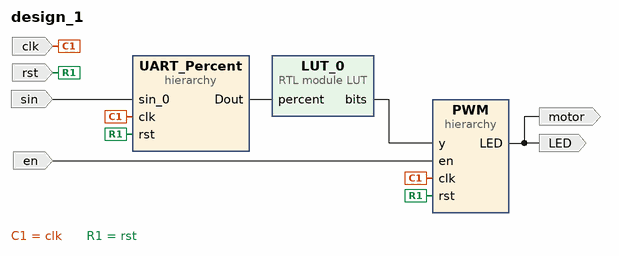
[diagram p0: block diagram of the top level]
# Vivado block design design_1, xc7z020clg400-1, Vivado 2021.1.1
create_bd_design design_1

create_bd_port -dir I -type clk clk
create_bd_port -dir I en
create_bd_port -dir I -type rst rst
create_bd_port -dir O LED
create_bd_port -dir I sin
create_bd_port -dir O motor

create_bd_cell -type hier PWM
create_bd_cell -type hier UART_Percent
create_bd_cell -type module -reference LUT LUT_0

# ---- hierarchy /PWM ----
current_bd_instance /PWM
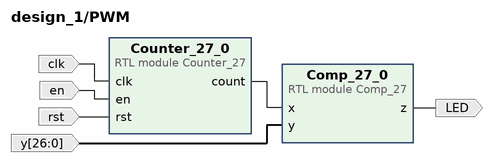
[diagram p1: block diagram inside /PWM]
create_bd_pin -dir I en
create_bd_pin -dir I -type clk clk
create_bd_pin -dir I -type rst rst
create_bd_pin -dir I -from 26 -to 0 y
create_bd_pin -dir O LED

create_bd_cell -type module -reference Comp_27 Comp_27_0
create_bd_cell -type module -reference Counter_27 Counter_27_0

# ---- hierarchy /UART_Percent ----
current_bd_instance /UART_Percent
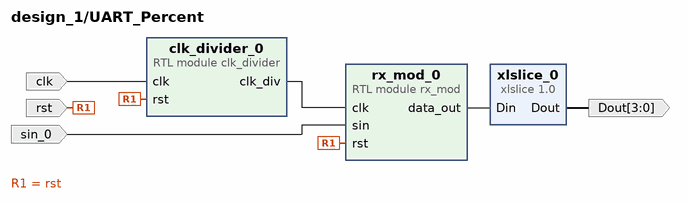
[diagram p2: block diagram inside /UART_Percent]
create_bd_pin -dir O -from 3 -to 0 Dout
create_bd_pin -dir I -type rst rst
create_bd_pin -dir I sin_0
create_bd_pin -dir I -type clk clk

create_bd_cell -type ip -vlnv xilinx.com:ip:xlslice:1.0 xlslice_0
set_property -dict {CONFIG.DIN_FROM 3 CONFIG.DIN_WIDTH 8 CONFIG.DOUT_WIDTH 4} [get_bd_cells xlslice_0]
create_bd_cell -type module -reference rx_mod rx_mod_0
create_bd_cell -type module -reference clk_divider clk_divider_0

# ---- connections ----

current_bd_instance /PWM
connect_bd_net [get_bd_pins Comp_27_0/z] [get_bd_pins LED]
connect_bd_net [get_bd_pins Counter_27_0/count] [get_bd_pins Comp_27_0/x]
connect_bd_net -net clk_0_1 [get_bd_pins clk] [get_bd_pins Counter_27_0/clk]
connect_bd_net -net en_0_1 [get_bd_pins en] [get_bd_pins Counter_27_0/en]
connect_bd_net -net rst_0_1 [get_bd_pins rst] [get_bd_pins Counter_27_0/rst]
connect_bd_net -net xlconstant_0_dout [get_bd_pins y] [get_bd_pins Comp_27_0/y]

current_bd_instance /UART_Percent
connect_bd_net -net clk_0_1 [get_bd_pins clk] [get_bd_pins clk_divider_0/clk]
connect_bd_net [get_bd_pins clk_divider_0/clk_div] [get_bd_pins rx_mod_0/clk]
connect_bd_net -net rst_0_1 [get_bd_pins rst] [get_bd_pins clk_divider_0/rst] [get_bd_pins rx_mod_0/rst]
connect_bd_net [get_bd_pins rx_mod_0/data_out] [get_bd_pins xlslice_0/Din]
connect_bd_net -net sin_0_1 [get_bd_pins sin_0] [get_bd_pins rx_mod_0/sin]
connect_bd_net [get_bd_pins xlslice_0/Dout] [get_bd_pins Dout]

current_bd_instance /
connect_bd_net -net Comp_27_0_z [get_bd_pins PWM/LED] [get_bd_ports LED] [get_bd_ports motor]
connect_bd_net [get_bd_pins LUT_0/bits] [get_bd_pins PWM/y]
connect_bd_net -net clk_0_1 [get_bd_ports clk] [get_bd_pins PWM/clk] [get_bd_pins UART_Percent/clk]
connect_bd_net -net en_0_1 [get_bd_ports en] [get_bd_pins PWM/en]
connect_bd_net -net rst_0_1 [get_bd_ports rst] [get_bd_pins PWM/rst] [get_bd_pins UART_Percent/rst]
connect_bd_net -net sin_0_1 [get_bd_ports sin] [get_bd_pins UART_Percent/sin_0]
connect_bd_net -net xlslice_0_Dout [get_bd_pins UART_Percent/Dout] [get_bd_pins LUT_0/percent]

validate_bd_design
save_bd_design
